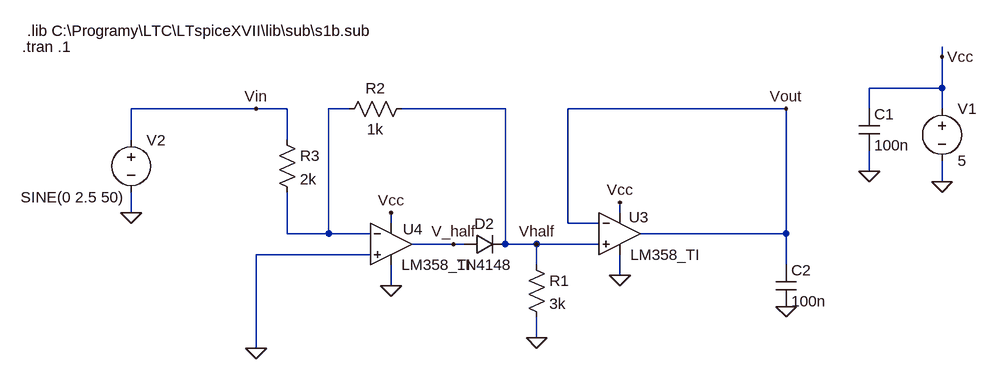
[diagram p0: schematic 11_rectifer.asc]
11_rectifer.asc, the LTspice schematic file:
Version 4
SHEET 1 1160 680
WIRE 1104 -144 1104 -160
WIRE 1104 -96 1104 -144
WIRE 1104 -96 992 -96
WIRE 48 -64 -144 -64
WIRE 96 -64 48 -64
WIRE 192 -64 160 -64
WIRE 432 -64 272 -64
WIRE 864 -64 528 -64
WIRE 992 -64 992 -96
WIRE 1104 -64 1104 -96
WIRE -144 -16 -144 -64
WIRE 96 -16 96 -64
WIRE 992 32 992 0
WIRE 1104 48 1104 16
WIRE -144 96 -144 64
WIRE 608 96 608 80
WIRE 256 112 256 96
WIRE 528 112 528 -64
WIRE 576 112 528 112
WIRE 96 128 96 64
WIRE 160 128 160 -64
WIRE 160 128 96 128
WIRE 224 128 160 128
WIRE 864 128 864 -64
WIRE 864 128 640 128
WIRE 352 144 288 144
WIRE 368 144 352 144
WIRE 432 144 432 -64
WIRE 480 144 432 144
WIRE 576 144 480 144
WIRE 224 160 48 160
WIRE 480 176 480 144
WIRE 864 176 864 128
WIRE 608 192 608 160
WIRE 256 208 256 176
WIRE 480 288 480 256
WIRE 48 304 48 160
FLAG 48 -64 Vin
FLAG 480 144 Vhalf
FLAG 864 -64 Vout
FLAG 1104 48 0
FLAG 1104 -144 Vcc
FLAG 608 80 Vcc
FLAG 256 96 Vcc
FLAG -144 96 0
FLAG 608 192 0
FLAG 48 304 0
FLAG 256 208 0
FLAG 480 288 0
FLAG 992 32 0
FLAG 864 240 0
FLAG 352 144 V_half
SYMBOL res 176 -48 R270
WINDOW 0 32 56 VTop 2
WINDOW 3 0 56 VBottom 2
SYMATTR InstName R2
SYMATTR Value 1k
SYMATTR SpiceLine tol=1
SYMBOL voltage 1104 -80 R0
WINDOW 123 0 0 Left 2
WINDOW 39 0 0 Left 2
SYMATTR InstName V1
SYMATTR Value 5
SYMBOL voltage -144 -32 R0
WINDOW 3 -170 104 Left 2
WINDOW 123 0 0 Left 2
WINDOW 39 0 0 Left 2
SYMATTR Value SINE(0 2.5 50)
SYMATTR InstName V2
SYMBOL diode 368 128 M90
WINDOW 0 0 32 VBottom 2
WINDOW 3 32 32 VTop 2
SYMATTR InstName D2
SYMATTR Value 1N4148
SYMBOL res 464 160 R0
SYMATTR InstName R1
SYMATTR Value 3k
SYMATTR SpiceLine tol=1
SYMBOL res 80 -32 R0
SYMATTR InstName R3
SYMATTR Value 2k
SYMATTR SpiceLine tol=1
SYMBOL cap 976 -64 R0
SYMATTR InstName C1
SYMATTR Value 100n
SYMBOL SBORKA\\OPamp\\LM358_TI 608 128 R0
WINDOW 38 0 32 Left 2
WINDOW 0 14 -25 Left 2
SYMATTR InstName U3
SYMBOL SBORKA\\OPamp\\LM358_TI 256 144 R0
WINDOW 38 -31 43 Left 2
WINDOW 0 18 -23 Left 2
SYMATTR InstName U4
SYMBOL cap 848 176 R0
SYMATTR InstName C2
SYMATTR Value 100n
TEXT -312 -160 Left 2 !.tran .1
TEXT -304 -184 Left 2 !.lib C:\\Programy\\LTC\\LTspiceXVII\\lib\\sub\\s1b.sub

The netlist it stands for:
* 11_rectifer.asc
R2 N001 Vhalf 1k tol=1
V1 Vcc 0 5
V2 Vin 0 SINE(0 2.5 50)
D2 V_half Vhalf 1N4148
R1 Vhalf 0 3k tol=1
R3 Vin N001 2k tol=1
C1 Vcc 0 100n
* U3: LM358_TI (symbol SBORKA\OPamp\LM358_TI not available, pins judged from their places): In+=Vhalf In-=Vout V+=Vcc V-=0 OUT=Vout
* U4: LM358_TI (symbol SBORKA\OPamp\LM358_TI not available, pins judged from their places): In+=0 In-=N001 V+=Vcc V-=0 OUT=V_half
C2 Vout 0 100n
.model D D
.lib standard.dio
.tran .1
.lib C:\Programy\LTC\LTspiceXVII\lib\sub\s1b.sub
.backanno
.end